# EAGLE schematic BlueDaq_V1.0 (EAGLE 7.5.0)
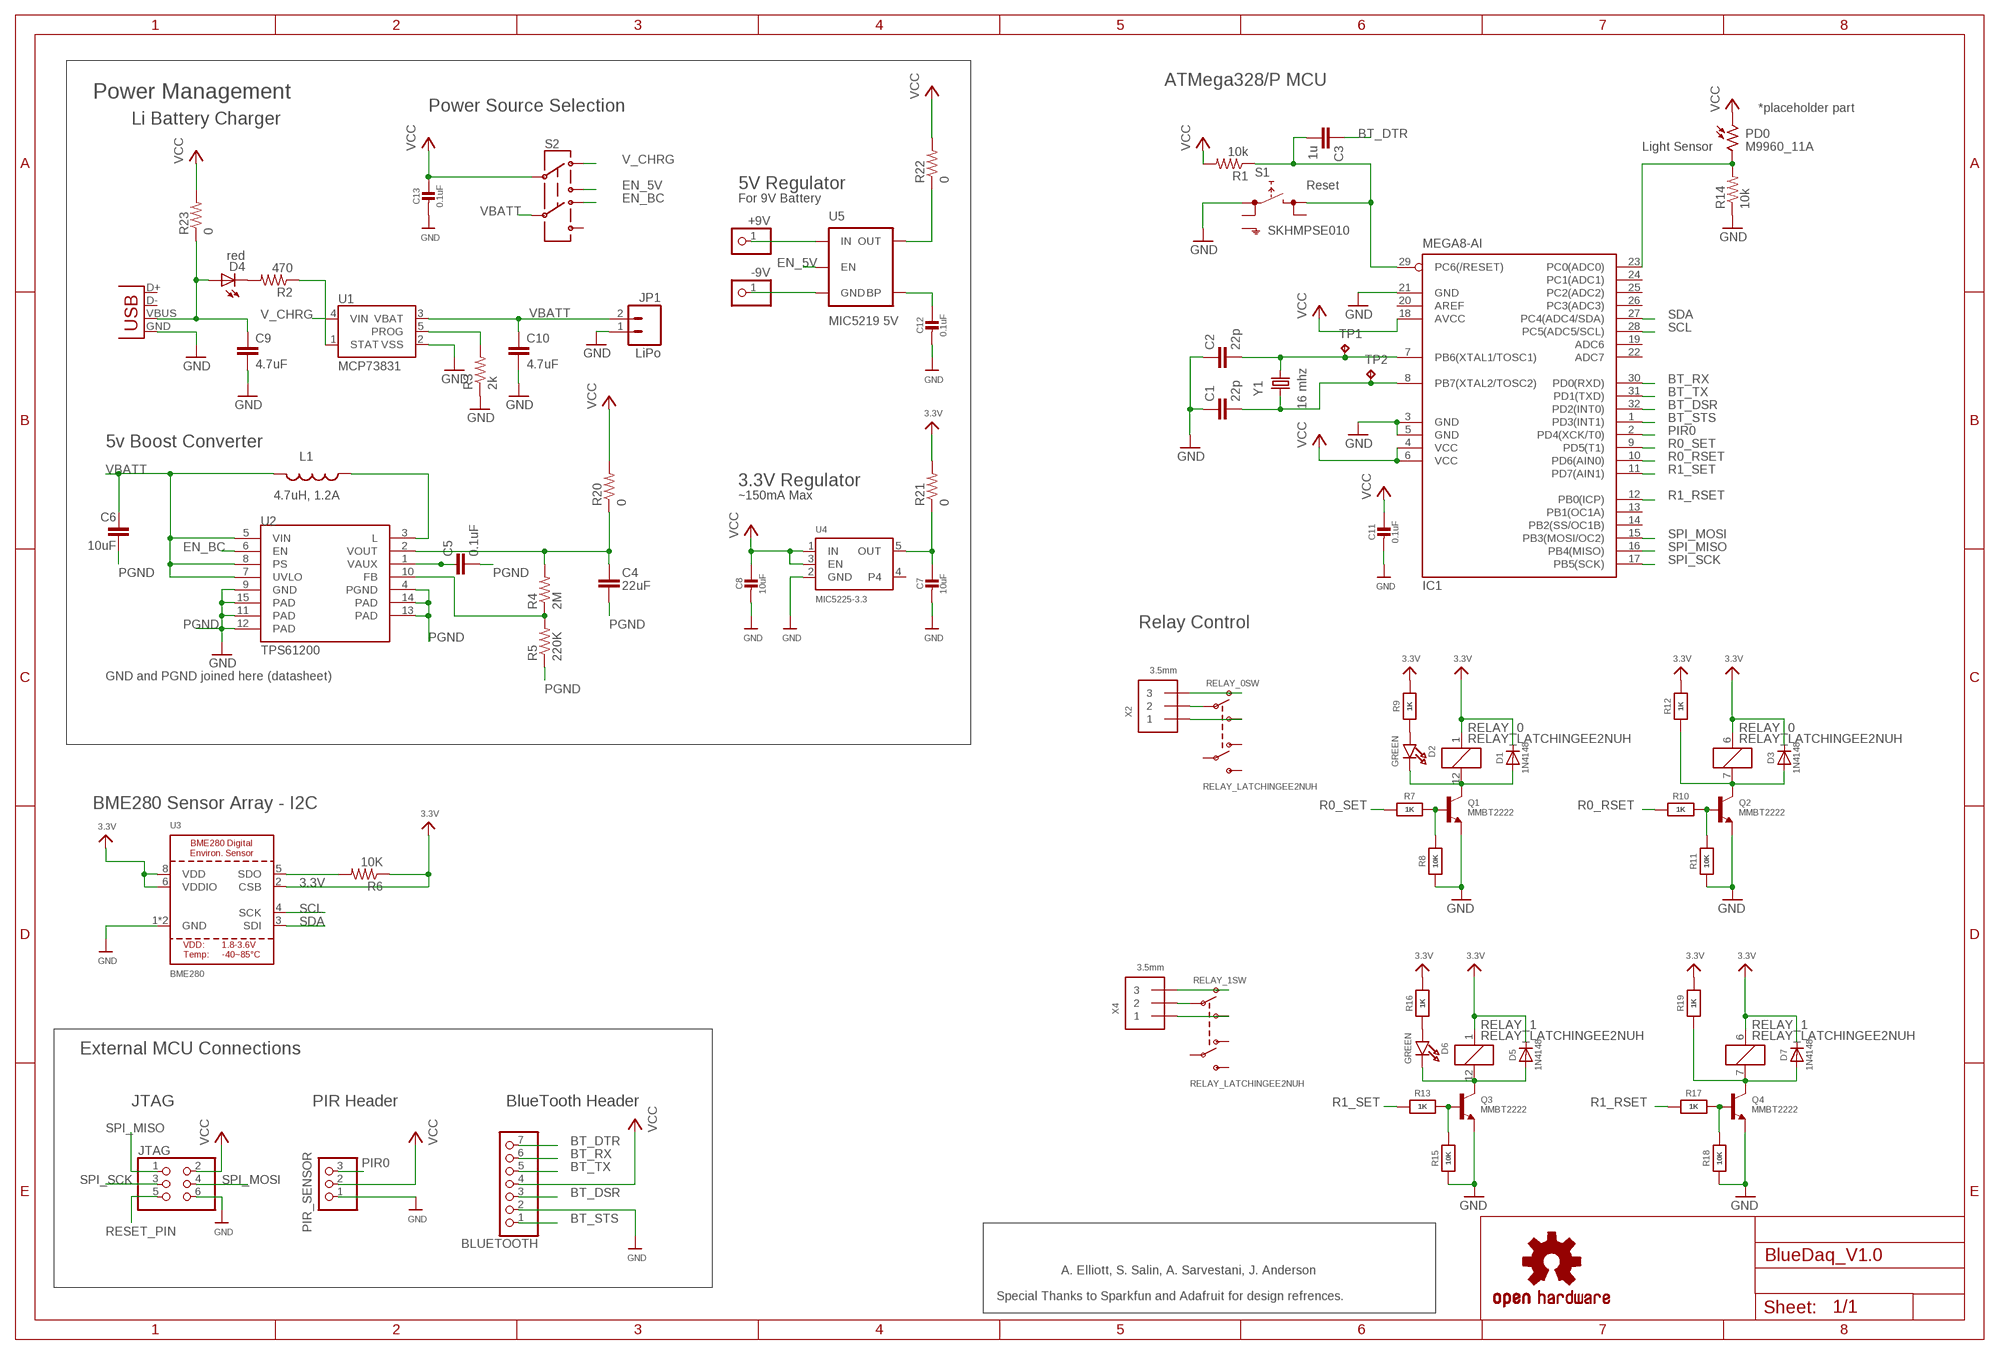
[diagram p0: schematic, sheet 1]

## Parts
+9V  PINHD-1X1  [1X01]
-9V  PINHD-1X1  [1X01]
BLUETOOTH  PINHD-1X7  [1X07]
C1  22p  C-EUC0603  [C0603]
C2  22p  C-EUC0603  [C0603]
C3  1u  C-EUC0603  [C0603]
C4  22uF  CAP0805  [0805]
C5  0.1uF  CAP0402-CAP  [0402-CAP]
C6  10uF  CAP1206  [1206]
C7  10uF  CAP_CERAMIC0805-NOOUTLINE  [0805-NO@1]
C8  10uF  CAP_CERAMIC0805-NOOUTLINE  [0805-NO@1]
C9  4.7uF  CAP0402-CAP  [0402-CAP]
C10  4.7uF  CAP0402-CAP  [0402-CAP]
C11  0.1uF  CAP_CERAMIC0805-NOOUTLINE  [0805-NO@1]
C12  0.1uF  CAP_CERAMIC0805-NOOUTLINE  [0805-NO@1]
C13  0.1uF  CAP_CERAMIC0805-NOOUTLINE  [0805-NO@1]
D1  1N4148  DIODESOD-323  [SOD-323]
D2  GREEN  LED0805_NOOUTLINE  [CHIPLED_0805_NOOUTLINE]
D3  1N4148  DIODESOD-323  [SOD-323]
D4  red  LED0603  [LED-0603]
D5  1N4148  DIODESOD-323  [SOD-323]
D6  GREEN  LED0805_NOOUTLINE  [CHIPLED_0805_NOOUTLINE]
D7  1N4148  DIODESOD-323  [SOD-323]
IC1  MEGA8-AI  [TQFP32-08]
JP1  LiPo  M02-JST-2MM-SMT  [JST-2-SMD]
JTAG  PINHD-2X3  [2X03]
L1  4.7uH, 1.2A  INDUCTOR.  [CDRH2D09]
PD0  M9960_11A  [M9960]
PIR_SENSOR  PINHD-1X3  [1X03]
Q1  MMBT2222  TRANSISTOR_NPN  [SOT23-R]
Q2  MMBT2222  TRANSISTOR_NPN  [SOT23-R]
Q3  MMBT2222  TRANSISTOR_NPN  [SOT23-R]
Q4  MMBT2222  TRANSISTOR_NPN  [SOT23-R]
R1  10k  R-US_R0805  [R0805]
R2  470  R-US_R0805  [R0805]
R3  2k  R-US_R0805  [R0805]
R4  2M  R-US_R0805  [R0805]
R5  220K  R-US_R0805  [R0805]
R6  10K  R-US_R0805  [R0805]
R7  1K  RESISTOR0805_NOOUTLINE  [0805-NO]
R8  10K  RESISTOR0805_NOOUTLINE  [0805-NO]
R9  1K  RESISTOR0805_NOOUTLINE  [0805-NO]
R10  1K  RESISTOR0805_NOOUTLINE  [0805-NO]
R11  10K  RESISTOR0805_NOOUTLINE  [0805-NO]
R12  1K  RESISTOR0805_NOOUTLINE  [0805-NO]
R13  1K  RESISTOR0805_NOOUTLINE  [0805-NO]
R14  10k  R-US_R0805  [R0805]
R15  10K  RESISTOR0805_NOOUTLINE  [0805-NO]
R16  1K  RESISTOR0805_NOOUTLINE  [0805-NO]
R17  1K  RESISTOR0805_NOOUTLINE  [0805-NO]
R18  10K  RESISTOR0805_NOOUTLINE  [0805-NO]
R19  1K  RESISTOR0805_NOOUTLINE  [0805-NO]
R20  0  R-US_R0805  [R0805]
R21  0  R-US_R0805  [R0805]
R22  0  R-US_R0805  [R0805]
R23  0  R-US_R0805  [R0805]
RELAY_0  RELAY_LATCHINGEE2NUH  [RELAY_EE2_LATCH]
RELAY_1  RELAY_LATCHINGEE2NUH  [RELAY_EE2_LATCH]
S1  SKHMPSE010  [SKHMPXE010]
S2  SWITCH-DPDTEG2211  [EG2211]
TP1  TPTP19SQ  [TP19SQ]
TP2  TPTP19SQ  [TP19SQ]
U1  MCP73831  [SOT23-5]
U2  TPS61200  [QFN-10_PAD]
U3  BME280  [BME280]
U4  MIC5225-3.3  VREG_SOT23-5  [SOT23-5]
U5  MIC5219 5V  V_REG_MIC52195V  [SOT23-5]
U$22  OSHW-LOGOS  [OSHW-LOGO-S]
X1  USB-MICROB  [USB-MICROB]
X2  3.5mm  TERMBLOCK_1X3  [TERMBLOCK_1X3-3.5MM]
X4  3.5mm  TERMBLOCK_1X3  [TERMBLOCK_1X3-3.5MM]
Y1  16 mhz  CRYSTALHC49UV  [HC49U-V]

## Nets
3.3V: D1.C D3.C D5.C D7.C R6.1 R9.2 R12.2 R16.2 R19.2 R21.2 RELAY_0.1 RELAY_0.6 RELAY_1.1 RELAY_1.6 U3.2(CSB) U3.6(VDDIO) U3.8(VDD)
BT_DSR: BLUETOOTH.3 IC1.32(PD2(INT0))
BT_DTR: BLUETOOTH.7 C3.1
BT_RX: BLUETOOTH.6 IC1.30(PD0(RXD))
BT_STS: BLUETOOTH.1 IC1.1(PD3(INT1))
BT_TX: BLUETOOTH.5 IC1.31(PD1(TXD))
COM1 [HV]: RELAY_0.9(SW:P1) X2.2
COM2 [HV]: RELAY_1.9(SW:P1) X4.2
EN_5V: S2.P1-TB U5.3(EN)
EN_BC: S2.P2-TA U2.6(EN)
FB: R4.1 R5.2 U2.10(FB)
GND: BLUETOOTH.2 C1.1 C2.1 C7.2 C8.2 C9.2 C10.2 C11.2 C12.2 C13.2 IC1.3(GND) IC1.5(GND) IC1.21(GND) JP1.1 JTAG.6 PIR_SENSOR.1 Q1.2(E) Q2.2(E) Q3.2(E) Q4.2(E) R3.1 R8.1 R11.1 R14.1 R15.1 R18.1 S1.1(1.1) U1.2(VSS) U3.1(GND) U3.7(GND) U4.2(GND) X1.GND
N$1: IC1.23(PC0(ADC0)) PD0.2 R14.2
N$2: L1.P$1 U2.3(L)
N$3: C5.1 U2.1(VAUX)
N$4: D4.C R2.2
N$5: R6.2 U3.5(SDO)
N$6: D1.A D2.C Q1.3(C) RELAY_0.12
N$7: D5.A D6.C Q3.3(C) RELAY_1.12
N$8: Q3.1(B) R13.2 R15.2
N$9: D6.A R16.1
N$10 [HV]: RELAY_1.10(SW:O1) X4.3
N$11: R3.2 U1.5(PROG)
N$12: D7.A Q4.3(C) R19.1 RELAY_1.7
N$13: Q4.1(B) R17.2 R18.2
N$14: R2.1 U1.1(STAT)
N$15: +9V.1 U5.1(IN)
N$16: -9V.1 U5.2(GND)
N$17: C12.1 U5.4(BP)
N$20: C4.1 R4.2 R20.1 U2.2(VOUT)
N$21: R22.1 U5.5(OUT)
N$22: Q1.1(B) R7.2 R8.2
N$23: C9.1 D4.A R23.1 X1.VBUS
N$25: D3.A Q2.3(C) R12.1 RELAY_0.7
N$26: D2.A R9.1
N$27: Q2.1(B) R10.2 R11.2
N$28 [HV]: RELAY_0.10(SW:O1) X2.3
NO1 [HV]: RELAY_0.8(SW:S1) X2.1
NO2 [HV]: RELAY_1.8(SW:S1) X4.1
OUT: C7.1 R21.1 U4.5(OUT)
PGND: C4.2 C5.2 C6.2 R5.1 U2.4(PGND) U2.9(GND) U2.11(PAD) U2.12(PAD) U2.13(PAD) U2.14(PAD) U2.15(PAD) ; supply symbol labelled GND
PIR0: IC1.2(PD4(XCK/T0)) PIR_SENSOR.3
R0_RSET: IC1.10(PD6(AIN0)) R10.1
R0_SET: IC1.9(PD5(T1)) R7.1
R1_RSET: IC1.12(PB0(ICP)) R17.1
R1_SET: IC1.11(PD7(AIN1)) R13.1
RESET_PIN: C3.2 IC1.29(PC6(/RESET)) JTAG.5 R1.1 S1.3(2.1)
SCL: IC1.28(PC5(ADC5/SCL)) U3.4(SCK)
SDA: IC1.27(PC4(ADC4/SDA)) U3.3(SDI)
SPI_MISO: IC1.16(PB4(MISO)) JTAG.1
SPI_MOSI: IC1.15(PB3(MOSI/OC2)) JTAG.4
SPI_SCK: IC1.17(PB5(SCK)) JTAG.3
V_CHRG: S2.P1-TA U1.4(VIN)
VBATT: C6.1 C10.1 JP1.2 L1.P$2 S2.P2 U1.3(VBAT) U2.5(VIN) U2.7(UVLO) U2.8(PS)
VCC: BLUETOOTH.4 C8.1 C11.1 C13.1 IC1.4(VCC) IC1.6(VCC) IC1.18(AVCC) JTAG.2 PD0.1 PIR_SENSOR.2 R1.2 R20.2 R22.2 R23.2 S2.P1 U4.1(IN) U4.3(EN)
XTAL1: C2.2 IC1.7(PB6(XTAL1/TOSC1)) TP1.TP Y1.2
XTAL2: C1.2 IC1.8(PB7(XTAL2/TOSC2)) TP2.TP Y1.1
Unconnected: IC1.13(PB1(OC1A)) IC1.14(PB2(SS/OC1B)) IC1.19(ADC6) IC1.20(AREF) IC1.22(ADC7) IC1.24(PC1(ADC1)) IC1.25(PC2(ADC2)) IC1.26(PC3(ADC3)) RELAY_0.3(SW:O2) RELAY_0.4(SW:P2) RELAY_0.5(SW:S2) RELAY_1.3(SW:O2) RELAY_1.4(SW:P2) RELAY_1.5(SW:S2) S1.2(1.2) S1.4(2.2) S1.5(SH) S2.P2-TB U4.4 X1.D+ X1.D-

## Notes on the sheet
- ATMega328/P MCU
- Power Management
- Power Source Selection | *placeholder part
- Li Battery Charger
- Light Sensor
- 5V Regulator | Reset
- For 9V Battery
- 5v Boost Converter
- 3.3V Regulator
- ~150mA Max
- Relay Control
- GND and PGND joined here (datasheet)
- BME280 Sensor Array - I2C
- External MCU Connections
- JTAG | PIR Header | BlueTooth Header
- A. Elliott, S. Salin, A. Sarvestani, J. Anderson
- Special Thanks to Sparkfun and Adafruit for design refrences.
- Z:/Documents/School/ECE 411 & Capstone/BlueDaq Logo.bmp

## Library data of the parts
+9V -9V = adafruit:PINHD-1X1: Pin header 1x1 for 0.1" spacing With round pins
BLUETOOTH = pinhead:PINHD-1X7: PIN HEADER
C1-C3 = rcl:C-EU: CAPACITOR, European symbol
C4 C6 = CH_passive:CAP: Capacitor Standard 0603 ceramic capacitor, and 0.1" leaded capacitor.
C5 C9 C10 = SparkFun:CAP: Capacitor Standard 0603 ceramic capacitor, and 0.1" leaded capacitor.
C7 C8 C11-C13 = microbuilder:CAP_CERAMIC: Ceramic Capacitors For new designs, use the packages preceded by an '_' character since they are more reliable: The following footprints should be used on most boards: _0402 - Standard footprint for regular board layouts _0603 - Standard footprint for regular board layouts _0805 - Standard footprint for regular board layouts _1206 - Standard footprint for regular board layouts For extremely tight-pitch boards where space is at a premium, the following 'micro-pitch' footprints can be used (smaller pads, no silkscreen outline, etc.): _0402MP - Micro-pitch footprint for very dense/compact boards _0603MP - Micro-pitch footprint for very dense/compact boards _0805MP - Micro-pitch footprint for very dense/compact boards _1206MP - Micro-pitch footprint for very dense/compact boards
D1 D3 D5 D7 = microbuilder:DIODE: Diode SMA Model Volts Amps Type Vf Ir Digikey # Notes SSA34-E3 40V 3A Schottky 480mV @ 3A 200uA @ 40V SSA34-E3/61TGITR-ND CDBA120-G 20V 1A Schottky 500mV @ 1A 500uA @ 20V 641-1014-6-ND REEL MBRA210 10V 2A Schottky 350mV @ 2A 700uA @ 10V MBRA210LT3 SOD-123 Model Volts Amps Type Vf Ir Order # Notes BAT54T1G 30V 200mA Schottky 800mV @ 200mA 2uA @ 25V BAT54T1GOSTR-ND B0530W 30V 500mA Schottky 430mV @ 500mA 130uA @ 30V B0530W-FDICT-ND REEL MBR120 20V 1A Schottky 340mV @ 1A MBR120VLSFT1GOSCT-ND SOD-323 Model Volts Amps Type Vf Ir Order # Notes PMEG2005EJ 20V 500mA Schottky 355mV @ 500mA 568-4110-1-ND ZLLS410 10V 570mA Schottky 380mV @ 570mA ZLLS410CT-ND 1N4148WS 75V 150mA Silicon/Simple 1V 1N4148WSFSCT-ND REEL SOD-523 Model Volts Amps Type Vf Ir Order # Notes BAT54XV2 30V 200mA Schottky 0.8V @ 100mA BAT54XV2CT-ND TB751S 30V 30mA Schottky RB751S-40TE61CT-ND SOT23-R/W (R = Solder Paste/Reflow Ovens, W = Hand-Soldering) Model Volts Amps Type Vf Ir Order # Notes BAT54FILM 40V 300mA Schottky 497-7162-1-ND POWERDI-5 Model Volts Amps Type Vf Ir Order # Notes PDS560 60V 5A Schottky 670mV @ 5A 150uA @ 60V PDS560DICT-ND
D2 D6 = microbuilder:LED: LED 0603 - 0603 Surface Mount Package 2mA: Green LED - Low Power (3.9mcd, 2ma, 1.7Vf) - Digikey: 475-2709-2-ND Orange LED - Low Power (9.8mcd, 2ma, 1.8Vf) - Digikey: 475-1194-2-ND Red LED - Low Power (5mcd, 2ma, 1.8Vf) - Digikey: 475-1195-2-ND Yellow LED - Low Power (7mcd, 2ma, 1.8Vf) - Digikey: 475-1196-2-ND 5mA: Blue LED - Low Power (17mcd, 5ma, 2.9Vf) - Digikey: LNJ937W8CRACT-ND 0805 - 0805 Surface Mount Package 2mA: Red LED (8.8mcd, 2mA, 1.8Vf, Clear) - Low Power [Digikey: 475-2510-1-ND] Green LED (5mcd, 2mA, 1.8Vf, Clear) - Low Power [Digikey: 475-2730-1-ND] Yellow LED (11.3mcd, 2mA, 1.8Vf, Clear) - Low Power [Digikey: 475-2555-1-ND] 20mA: Red LED (104mcd, 20mA, Diffused) - LS R976 [Digikey: 475-1278-6-ND] Red LED (12mcd, 20mA, 2.0Vf, Clear) - APT2012EC [Digikey: 754-1128-1-ND] Green LED (15mcd, 20mA, 2.2Vf, Clear) - APT2012GC [Digikey: 754-1131-1-ND] Orange LED (160mcd, 20mA, 2.1Vf, Clear) - APT2012SECK [Digikey: 754-1130-1-ND] 1206 - 1206 Surface Mount Package Green LED (26mcd, 20mA, Diffused) - LG N971 [Digikey: 475-1407-6-ND] Red LED (15mcd, 20mA, Diffused) - LH N974 [Digikey: 475-1416-6-ND] Cree - Cree High-Power Surface Mount LEDs XPEBWT-L1-0000-00D50 - White 111lm 350mA 2.9Vf 6200K 110° XTEAWT-00-0000-00000LEE3 - White 114lm 350mA 2.85Vf 5000K 115° Everlight - Everlight 45-21 Series Surface Mount LEDs 45-21/QK2C-B2832AC2CB2/2T - Warm White 2000mcd 20mA 3.25Vf 3050K 120° 45-21/LK2C-B38452C4CB2/2T - Nuetral White 2000mcd 20mA 3.25Vf 4150K 120° 45-21/LK2C-B50634C6CB2/2T - Cold White 2200mcd 20mA 3.25Vf 5650K 120° PLCC2 Reverse Mount LS T77K-J1L2-1-0-2-R18-Z - Red 11.25mcd 2mA 1.8Vf 630nm 120° LO T77K-L1M2-24-Z - Orange 19.6mcd 2mA 1.8Vf 606nm 120° LY T77K-K2M1-26-Z - Yellow 15.7mcd 2mA 1.8Vf 587nm 120°
D4 = SparkFun:LED: LEDs Standard schematic elements and footprints for 5mm, 3mm, 1206, and 0603 sized LEDs. 5mm - Spark Fun Electronics SKU : COM-00529 (and others)
IC1 = atmel:MEGA8: MICROCONTROLLER 8 Kbytes FLASH, 1 kbytes SRAM, 512 bytes EEPROM, USART, 6-channel 10 bit ADC, 2-channel 8 bit ADC Pin compatible with Atmega48, ATMega88, ATMega168 Source: avr.lbr; MPN: ATMEGA8-16AU; OC_FARNELL: 9171371; OC_NEWARK: 73M8863
JP1 = SparkFun:M02: Header 2 Standard 2-pin 0.1" header. Use with straight break away headers (SKU : PRT-00116), right angle break away headers (PRT-00553), swiss pins (PRT-00743), machine pins (PRT-00117), and female headers (PRT-00115). Molex polarized connector foot print use with SKU : PRT-08233 with associated crimp pins and housings.
JTAG = pinhead:PINHD-2X3: PIN HEADER
L1 = SparkFun:INDUCTOR: Inductors Basic Inductor/Choke - 0603 and 1206. Footprints are not proven and vary greatly between part numbers.
PD0 = photo-elements:M9960_11: Photo Sensor Beacon Light, Photometer Applications Source: http://optoelectronics.perkinelmer.com/content/Datasheets/DTS_M9960.pdf
PIR_SENSOR = pinhead:PINHD-1X3: PIN HEADER
Q1-Q4 = microbuilder:TRANSISTOR_NPN: NPN Transistor Transistor (NPN) 500mA 45V - BC817 [Digikey: 568-1631-1-ND] Transistor (NPN) 500mA 45V - BC817,215 [Mouser: 771-BC817-T/R] SOT23-R - SOT23 footprint optimised for use with solder paste and reflow ovens. SOT23-W - SOT23 footprint optimised for hand-soldering (larger pads).
R1-R6 R14 R20-R23 = adafruit:R-US_: RESISTOR, American symbol
R7-R13 R15-R19 = microbuilder:RESISTOR: Resistors For new designs, use the packages preceded by an '_' character since they are more reliable: The following footprints should be used on most boards: _0402 - Standard footprint for regular board layouts _0603 - Standard footprint for regular board layouts _0805 - Standard footprint for regular board layouts _1206 - Standard footprint for regular board layouts For extremely tight-pitch boards where space is at a premium, the following 'micro-pitch' footprints can be used (smaller pads, no silkscreen outline, etc.): _0402MP - Micro-pitch footprint for very dense/compact boards _0603MP - Micro-pitch footprint for very dense/compact boards _0805MP - Micro-pitch footprint for very dense/compact boards _1206MP - Micro-pitch footprint for very dense/compact boards
RELAY_0 RELAY_1 = microbuilder:RELAY_LATCHING
S1 = switch:SKHMP*E010: 6.2 X 6.5mm TACT Switch (SMD) Source: http://www3.alps.co.jp/WebObjects/catalog.woa/PDF/E/Switch/Tact/SKHM/SKHM.PDF
S2 = SparkFun-Electromechanical:SWITCH-DPDT: DPDT Version of the COM-00597
TP1 TP2 = testpad:TP: Test pad
U1 = SparkFun:MCP73831: Microchip's MCP73831 Miniature single cell, fully integrated Li-Ion, Li-polymer charge management controller http://ww1.microchip.com/downloads/en/DeviceDoc/21984a.pdf
U2 = SparkFun:TPS61200: DC to DC Booster
U3 = microbuilder:BME280: BME280 - Environmental Sensor (I2C + SPI)
U4 = microbuilder:VREG_SOT23-5: SOT23-5 Fixed Voltage Regulators Part Current Out V Out V In V Dropout θJA (°C/W) TJ (°C) Digikey Part No. ADP121 150mA 3.3V 3.4-5.5V 0.09V @ 150mA -- -- ADP121-AUJZ33R7CT-ND ADP121 150mA 3.0V 3.1-5.5V 0.09V @ 150mA -- -- ADP121-AUJZ30R7CT-ND ADP122 300mA 3.3V 3.4-5.5V 0.085V @ 300mA -- -- ADP122AUJZ-3.3-R7CT-ND ADP1712 300mA 3.3V 3.5-5.5V 0.17V @ 300mA -- -- ADP1712AUJZ-3.3-R7TR-ND AP7311 (Low Cost) 150mA 3.3V 3.5-6V 0.15V @ 150mA -- -- AP7311-33WG-7DICT-ND LD39015M18R 150mA 1.8V 1.9V-5.5V 0.08V @ 100mA -- -- 497-6977-1-ND LP2985A-33DBVR 150mA 3.3V 3.3-16V 0.28V @ 150mA 206 150 296-18479-1-ND MCP1824T-3302E/OT 300mA 3.3V 3.5V-6V 0.2V @ 300mA -- -- MCP1824T-3302E/OTCT-ND MIC5205-2.5YM5 TR 150mA 2.5V 2.7-16V 0.165V @ 150mA -- -- 576-1257-2-ND MIC5205-3.0YM5 TR 150mA 3.0V 3.2V-16V 0.165V @ 150mA -- -- 576-1258-2-ND MIC5205-3.3YM5 TR 150mA 3.3V 3.5V-16V 0.165V @ 150mA -- -- 576-1259-2-ND TPS780330220 150mA 3.3V+2.2V 3.6-5.5V 250mV Max -- -- 296-23332-1-ND TDA3663/N1,135 100mA 3.3V 3.5-45V 0.18V @ 50mA -- -- 568-5343-1-ND Max operating temp can be calculated using θJA, TJ (max junction temperature), and power in watts. Set the "Maximum Ambient Temperature" until it reaches TJ ("Max Junction Temperature"), which is the absolute limit for safe use of the regulator: Heat Sink Temperature Calculator <http://www.daycounter.com/Calculators/Heat-Sink-Temperature-Calculator.phtml> For example, With 12V source into a 3.3V LP2985 and a 30mA load, we are dissipating (12V-3.3V) * 0.03A = 0.261W. With a θJA of 206 °C/W, a TJ of 150°C, and 261mW we can safely use the chip without a heat sink up to 75°C (=147.1°C Junction Temperature).
U5 = SparkFun-PowerIC:V_REG_MIC5219: V_REG MIC5219 Standard 3.3V and 5V 500mA LDO voltage regulator in SOT-23 layout. Micrel part MIC5219. BP (by-pass) pin is used to lower output noise with 470pF cap, may be left open.; PROD_ID: VREG-10107
U$22 = SparkFun:OSHW-LOGO: Open Source Hardware Logo This logo indicates the piece of hardware it is found on incorporates a OSHW license and/or adheres to the definition of open source hardware found here: http://freedomdefined.org/OSHW
X1 = SparkFun:USB: USB Connectors USB-B-PTH is fully proven SKU : PRT-00139 USB-miniB is fully proven SKU : PRT-00587 USB-A-PCB is untested. USB-A-H is throughly reviewed, but untested. Spark Fun Electronics SKU : PRT-00437 USB-B-SMT is throughly reviewed, but untested. Needs silkscreen touching up. USB-A-S has not been used/tested USB-MB-H has not been used/tested
X2 X4 = microbuilder:TERMBLOCK_1X3: 3.5mm Terminal block http://www.ladyada.net/library/pcb/eaglelibrary.html
Y1 = SparkFun-FreqCtrl:CRYSTAL: Various standard crystals. Proven footprints.

## Net classes
1 HV: width 0.406 mm, drill 0.381 mm, clearance 1.016 mm